# Altium schematic sheet MOTOR1.SchDoc
size B
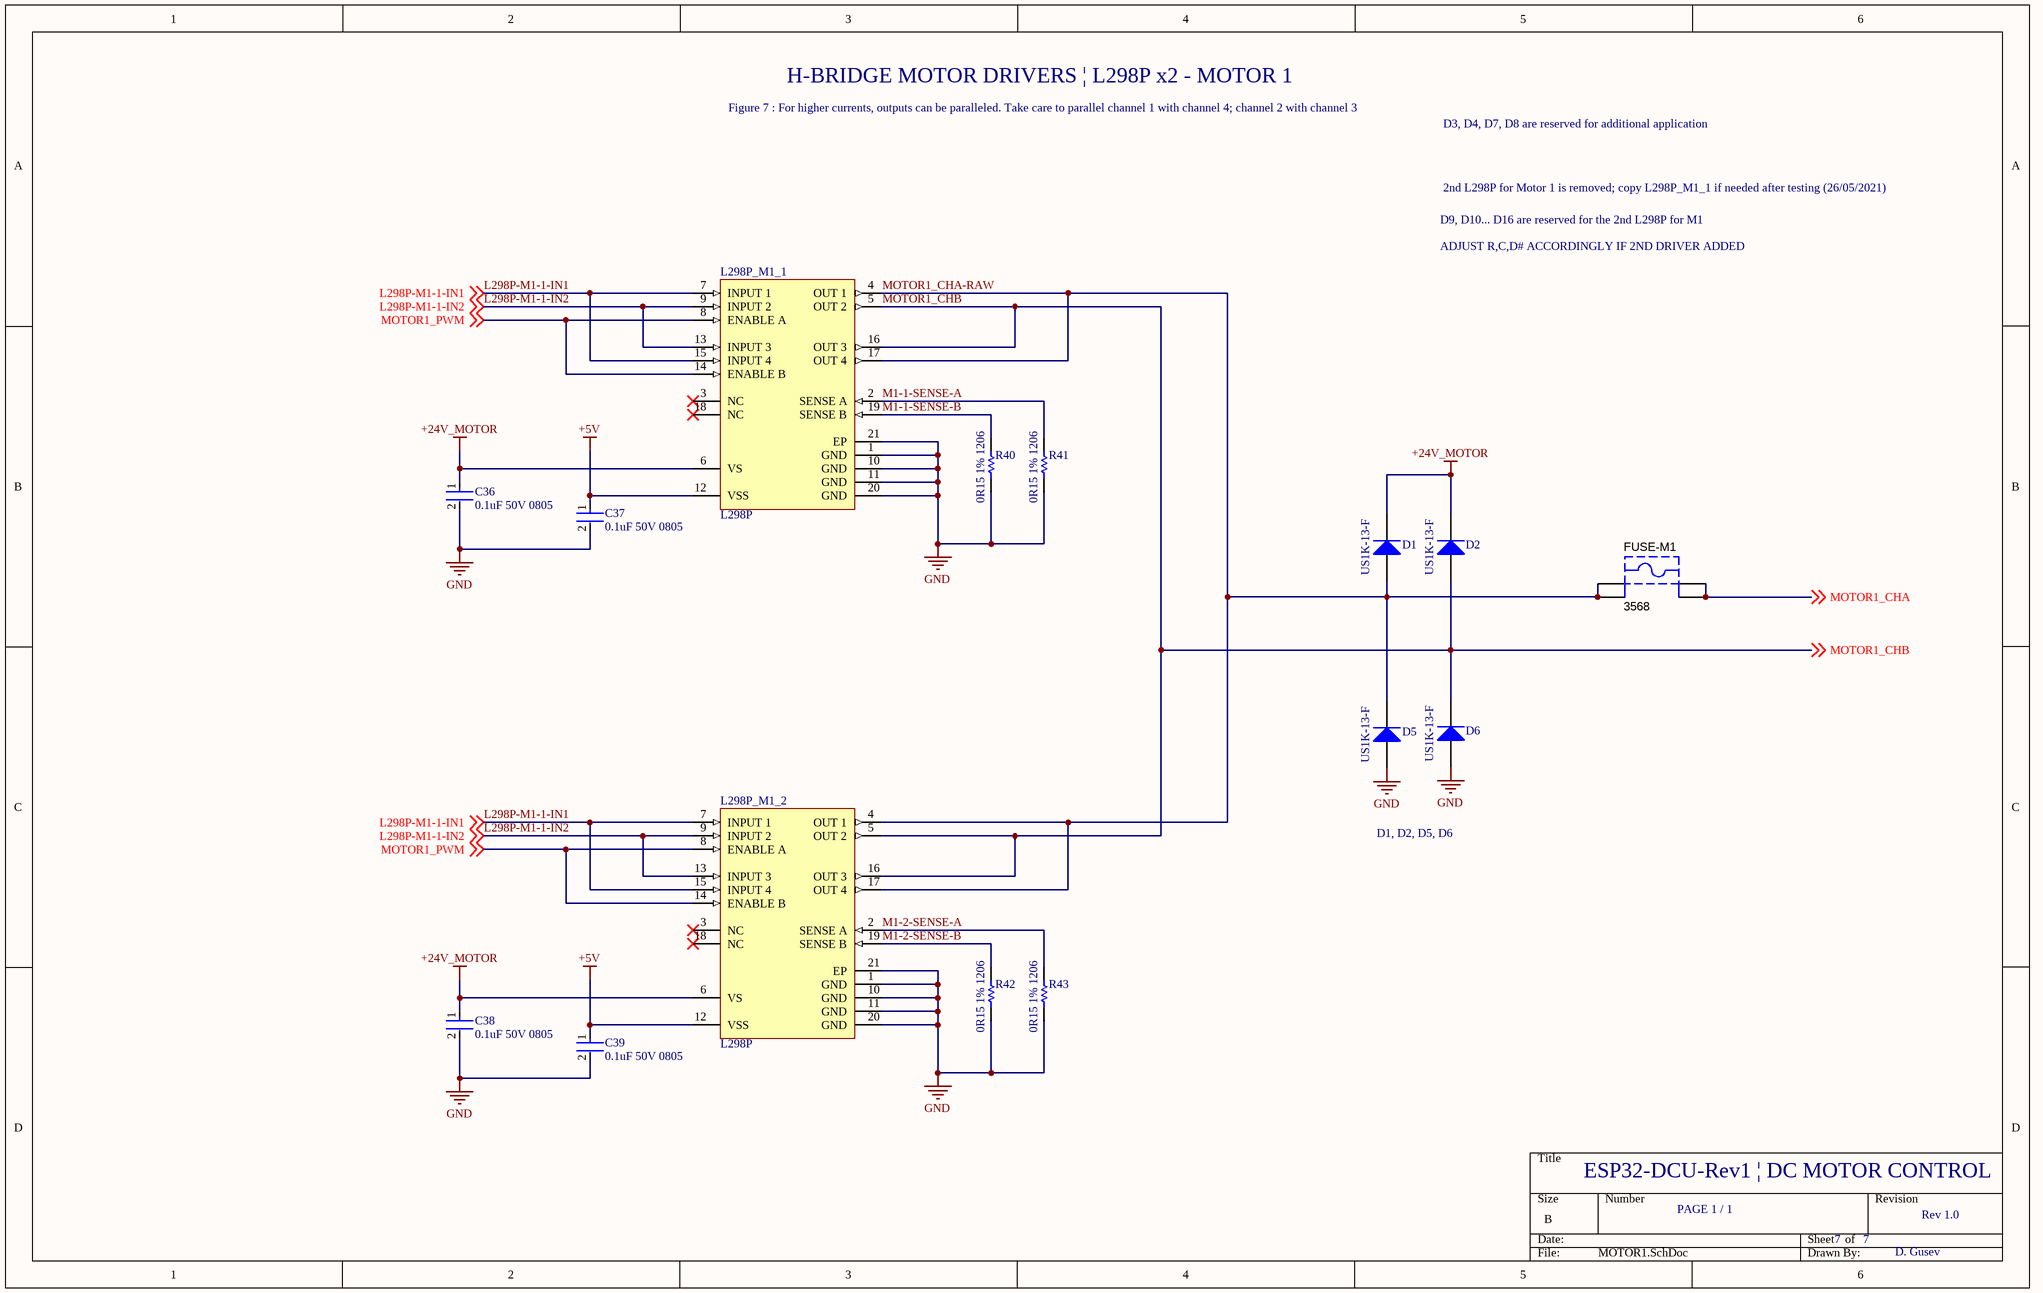
[diagram p0: MOTOR1.SchDoc]

## Parts
C36  0.1uF 50V 0805  [FP-C0805C-DN-MFG]
C37  0.1uF 50V 0805  [FP-C0805C-DN-MFG]
C38  0.1uF 50V 0805  [FP-C0805C-DN-MFG]
C39  0.1uF 50V 0805  [FP-C0805C-DN-MFG]
D1  US1K-13-F  [DIOD-SMA-2_A_V]
D2  US1K-13-F  [DIOD-SMA-2_A_V]
D5  US1K-13-F  [DIOD-SMA-2_A_V]
D6  US1K-13-F  [DIOD-SMA-2_A_V]
FUSE-M1  3568  [KSTN-3568_V]
L298P_M1_1  L298P  [L298P]
L298P_M1_2  L298P  [L298P]
R40  0R15 1% 1206  [RESC3116X65X40ML10T20]
R41  0R15 1% 1206  [RESC3116X65X40ML10T20]
R42  0R15 1% 1206  [RESC3116X65X40ML10T20]
R43  0R15 1% 1206  [RESC3116X65X40ML10T20]

## Nets
+5V: C37.1 C39.1 L298P_M1_1.12(VSS) L298P_M1_2.12(VSS)
+24V_MOTOR: C36.1 C38.1 D1.2(K) D2.2(K) L298P_M1_1.6(VS) L298P_M1_2.6(VS)
GND: C36.2 C37.2 C38.2 C39.2 D5.1(A) D6.1(A) L298P_M1_1.1(GND) L298P_M1_1.10(GND) L298P_M1_1.11(GND) L298P_M1_1.20(GND) L298P_M1_1.21(EP) L298P_M1_2.1(GND) L298P_M1_2.10(GND) L298P_M1_2.11(GND) L298P_M1_2.20(GND) L298P_M1_2.21(EP) R40.1 R41.1 R42.1 R43.1
L298P-M1-1-IN1: L298P_M1_1.7(INPUT_1) L298P_M1_1.15(INPUT_4) L298P_M1_2.7(INPUT_1) L298P_M1_2.15(INPUT_4) ; off-sheet L298P-M1-1-IN1
L298P-M1-1-IN2: L298P_M1_1.9(INPUT_2) L298P_M1_1.13(INPUT_3) L298P_M1_2.9(INPUT_2) L298P_M1_2.13(INPUT_3) ; off-sheet L298P-M1-1-IN2
M1-1-SENSE-A: L298P_M1_1.2(SENSE_A) R41.2
M1-1-SENSE-B: L298P_M1_1.19(SENSE_B) R40.2
M1-2-SENSE-A: L298P_M1_2.2(SENSE_A) R43.2
M1-2-SENSE-B: L298P_M1_2.19(SENSE_B) R42.2
MOTOR1_CHA: FUSE-M1.3 FUSE-M1.4 ; off-sheet MOTOR1_CHA
MOTOR1_CHA-RAW: D1.1(A) D5.2(K) FUSE-M1.1 FUSE-M1.2 L298P_M1_1.4(OUT_1) L298P_M1_1.17(OUT_4) L298P_M1_2.4(OUT_1) L298P_M1_2.17(OUT_4)
MOTOR1_CHB: D2.1(A) D6.2(K) L298P_M1_1.5(OUT_2) L298P_M1_1.16(OUT_3) L298P_M1_2.5(OUT_2) L298P_M1_2.16(OUT_3) ; off-sheet MOTOR1_CHB
MOTOR1_PWM: L298P_M1_1.8(ENABLE_A) L298P_M1_1.14(ENABLE_B) L298P_M1_2.8(ENABLE_A) L298P_M1_2.14(ENABLE_B) ; off-sheet MOTOR1_PWM

Not connected (* = marked no-connect by the designer): L298P_M1_1 3(NC)* 18(NC)*; L298P_M1_2 3(NC)* 18(NC)*

## Notes on the sheet
- H-BRIDGE MOTOR DRIVERS | L298P x2 - MOTOR 1
- Figure 7 : For higher currents, outputs can be paralleled. Take care to parallel channel 1 with channel 4; channel 2 with channel 3
- D3, D4, D7, D8 are reserved for additional application
- D9, D10... D16 are reserved for the 2nd L298P for M1
- 2nd L298P for Motor 1 is removed; copy L298P_M1_1 if needed after testing (26/05/2021)
- ADJUST R,C,D# ACCORDINGLY IF 2ND DRIVER ADDED
- D1, D2, D5, D6
- ESP32-DCU-Rev1 | DC MOTOR CONTROL
- PAGE 1 / 1
- 7
- Rev 1.0
- D. Gusev

## Library data of the parts
C36-C39 = CMP-2007-00279-2: CAP CER 0.1UF 50V X7R 0805; Manufacturer Part Number: C0805C104K5RACTU; Manufacturer: KEMET; Value: 0.10 μF; Tolerance: 0.1; Temperature Coefficient: 30ppm/°C; Material: Ceramic; Device Class L2: Capacitors; Temperature Range Low: -55°C; Voltage Rating: 50 V; Digikey Description: CAP CER 0.1UF 50V X7R 0805; Category: Cap; ComponentLink2Description: Datasheet; Octopart: https://octopart.com/c0805c104k5ractu-kemet-143926; RoHS: TRUE; ComponentLink2URL: https://content.kemet.com/datasheets/KEM_C1003_C0G_SMD.pdf; Temperature Characteristic: X7R; Temperature: -55°C to +125°C; Height: 0.88mm; Temperature Range High: +125°C; Device Class L1: Passive Components; Automotive: No; Lead Free: Yes; Ipc Land Pattern Name: CAPC200125X78; Device Class L3: Ceramic Capacitors; Mouser Description: Cap Ceramic 0.1uF 50V X7R 10% SMD 2.0 x 1.2 mm 125 C Paper T/R; Capacitance: 0.10 μF; Package: C0805C-DN
D1 D2 D5 D6 = CMP-1667-00001-4: Ultra-Fast Rectifier, 1 A, 1.7 V, -65 to 150 degC, 2-Pin SMD, RoHS, Tape and Reel; Manufacturer: Diodes Inc; ComponentLink2Description: Datasheet; PackageDescription: 2-Pin Surface Mount Device, Body 4.3 x 2.605 mm; Height: 2.1 mm; REACH SVHC: Yes; RoHSCompliant: true; Min Operating Temperature: -65 degC; Pins: 2; Packaging: Cut Tape; ComponentLink2URL: http://www.diodes.com/_files/datasheets/ds16008.pdf; Package Quantity: 1; Length: 4.6 mm; Max Operating Temperature: 150 degC; ComponentLink1URL: http://www.diodes.com/; ComponentLink1Description: Manufacturer URL; DatasheetVersion: Rev. 11-2, 12/2014; PackageReference: SMA-2; Mount: Surface Mount; Mounting Technology: Surface Mount
FUSE-M1 = CMP-2000-05464-1: Fuse Holder, 20 A, 500 V, -50 to 145 degC, 4-Pin THD, RoHS; Manufacturer: Keystone; Package Reference: 3568; Datasheet Version: 04/2013; Datasheet URL: https://datasheet.ciiva.com/16294/m60-2p40-16294706.pdf; Manufacturer URL: http://www.keyelco.com/; Mounting Technology: ThroughHole; Package Description: 4-Pin Through Hole Device, Body 16 x 6.73 mm, Pitch 9.9 mm
L298P_M1_1 L298P_M1_2 = L298P: Dual Full-Bridge Driver, 4.5 to 7 V, -25 to 130 degC, 20-Pin SOIC, RoHS, Tube; Manufacturer: STMicroelectronics; Output Current: 2A; Collector Emitter Voltage (VCEO): 46V; Min Supply Voltage: 4.8V; Max Collector Current: 3A; Supply Voltage: 42V; Number of Channels: 2; Operating Supply Current: 13mA; Packaging: Rail/Tube; Package Reference: PowerSO20; Width: 11.1mm; Radiation Hardening: No; Height: 3.3mm; Lead Free: LeadFree; Datasheet Version: 36526.0; Datasheet URL: http://www.st.com/content/ccc/resource/technical/document/datasheet/82/cc/3f/39/0a/29/4d/f0/CD00000240.pdf/files/CD00000240.pdf/jcr:content/translations/en.CD00000240.pdf; RoHSCompliant: true; Max Supply Voltage: 46V; Output Current per Channel: 2A; Package Description: 20-Pin Small Outline Integrated Circuits, Body 15.9 x 11 mm, Pitch 1.27 mm; Case/Package: SOIC; Min Operating Temperature: -25degC; Number of Pins: 20; Length: 16mm; Max Output Current: 3A; Package Quantity: 31; Max Operating Temperature: 130degC; Mount: SurfaceMount; Manufacturer URL: http://www.st.com/
R40-R43 = CMP-2003-04042-1: Manufacturer: Yageo; Part Number: RL1206JR-070R15L